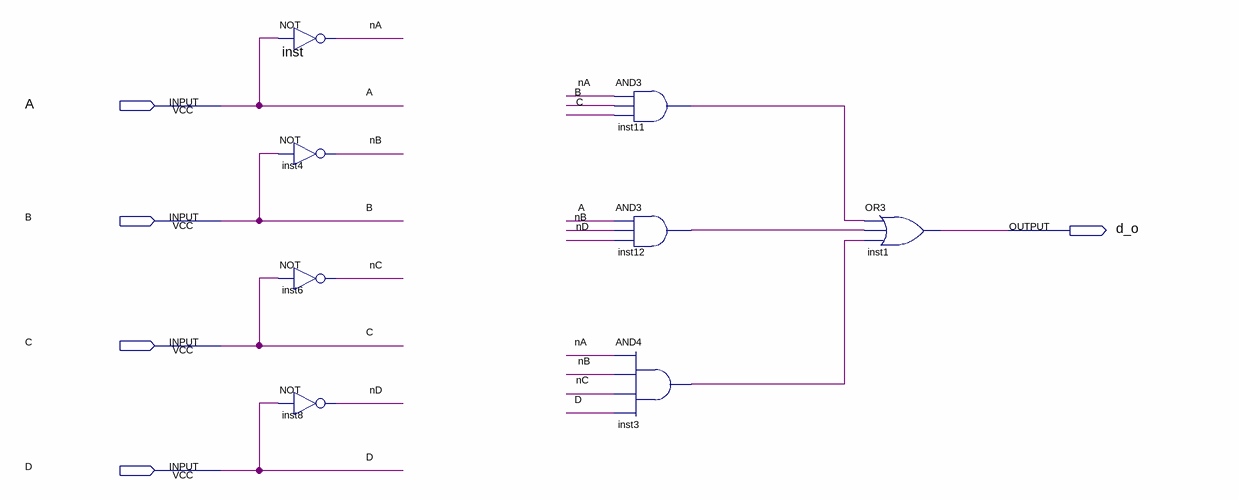
[diagram p0: schematic sheet]
// Quartus schematic d_out.bdf as structural Verilog: 8 symbols, 5 pins
module d_out (
  input  A,
  input  B,
  input  C,
  input  D,
  output d_o
);

  wire inst3_out, inst11_out, inst12_out, nA, nB, nC, nD;

  not inst (nA, A);
  not inst4 (nB, B);
  not inst6 (nC, C);
  not inst8 (nD, D);
  and inst11 (inst11_out, nA, B, C);
  and inst12 (inst12_out, A, nB, nD);
  and inst3 (inst3_out, nA, nB, nC, D);
  or inst1 (d_o, inst11_out, inst12_out, inst3_out);
endmodule
